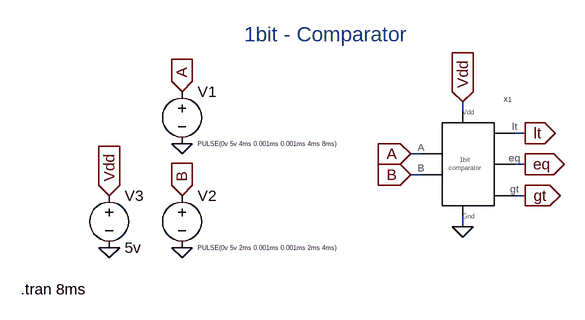
[diagram p0: schematic 1bit comparator symbol.asc]
1bit comparator symbol.asc, the LTspice schematic file:
Version 4
SHEET 1 880 680
WIRE 336 -64 336 -80
WIRE 432 -32 416 -32
WIRE 272 0 256 0
WIRE 432 16 416 16
WIRE 272 32 256 32
WIRE 432 64 416 64
WIRE 336 112 336 96
FLAG 336 112 0
FLAG -96 144 0
FLAG -96 -16 0
FLAG -208 144 0
FLAG -96 -96 A
IOPIN -96 -96 In
FLAG 256 0 A
IOPIN 256 0 In
FLAG 256 32 B
IOPIN 256 32 In
FLAG -96 64 B
IOPIN -96 64 In
FLAG 336 -80 Vdd
IOPIN 336 -80 In
FLAG -208 64 Vdd
IOPIN -208 64 In
FLAG 432 -32 lt
IOPIN 432 -32 Out
FLAG 432 16 eq
IOPIN 432 16 Out
FLAG 432 64 gt
IOPIN 432 64 Out
SYMBOL 1bitcomparator 336 0 R0
SYMATTR InstName X1
SYMBOL voltage -96 -112 R0
WINDOW 3 24 96 Left 0
WINDOW 123 0 0 Left 0
WINDOW 39 0 0 Left 0
SYMATTR Value PULSE(0v 5v 4ms 0.001ms 0.001ms 4ms 8ms)
SYMATTR InstName V1
SYMBOL voltage -96 48 R0
WINDOW 3 24 96 Left 0
WINDOW 123 0 0 Left 0
WINDOW 39 0 0 Left 0
SYMATTR Value PULSE(0v 5v 2ms 0.001ms 0.001ms 2ms 4ms)
SYMATTR InstName V2
SYMBOL voltage -208 48 R0
WINDOW 123 0 0 Left 0
WINDOW 39 0 0 Left 0
SYMATTR InstName V3
SYMATTR Value 5v
TEXT -344 208 Left 2 !.tran 8ms
TEXT 0 -184 Left 3 ;1bit - Comparator

The netlist it stands for:
* 1bit comparator symbol.asc
XX1 A B lt eq gt Vdd 0 1bitcomparator  ; pins A B lt eq gt Vdd gnd
V1 A 0 PULSE(0v 5v 4ms 0.001ms 0.001ms 4ms 8ms)
V2 B 0 PULSE(0v 5v 2ms 0.001ms 0.001ms 2ms 4ms)
V3 Vdd 0 5v
.tran 8ms
* 1bit - Comparator
.backanno
.end

* Results of the author's LTspice run, read from the files saved beside the schematic
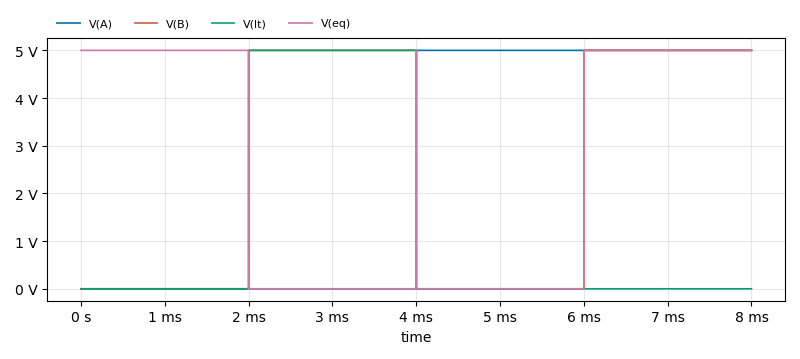
[diagram p1: Transient Analysis of 1bit comparator symbol.asc, plotted from the saved traces]
* Transient Analysis, 1 run:
*   V(A): min 0 V, max 5 V, average 2.5 V, rms 3.535 V, last 5 V
*   V(B): min 0 V, max 5 V, average 2.5 V, rms 3.536 V, last 5 V
*   V(lt): min 0 V, max 5 V, average 1.25 V, rms 2.5 V, last 0 V
*   V(eq): min 0 V, max 5 V, average 2.501 V, rms 3.536 V, last 5 V